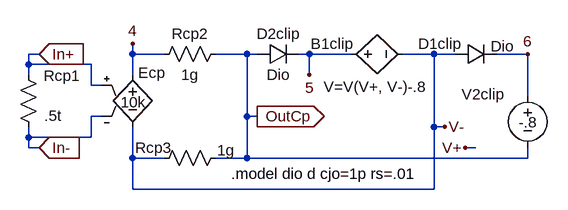
[diagram p0: schematic Comp.asc]
Comp.asc, the LTspice schematic file:
Version 4
SHEET 1 932 680
WIRE 96 176 96 160
WIRE 96 192 96 176
WIRE 96 288 96 272
WIRE 96 304 96 288
WIRE 112 160 96 160
WIRE 112 304 96 304
WIRE 192 176 96 176
WIRE 192 208 192 176
WIRE 192 288 96 288
WIRE 192 288 192 256
WIRE 208 208 192 208
WIRE 208 256 192 256
WIRE 256 160 256 144
WIRE 256 192 256 160
WIRE 256 320 256 272
WIRE 256 368 256 320
WIRE 304 160 256 160
WIRE 304 320 256 320
WIRE 432 160 384 160
WIRE 432 256 432 160
WIRE 432 320 384 320
WIRE 432 320 432 256
WIRE 448 160 432 160
WIRE 448 256 432 256
WIRE 528 160 512 160
WIRE 528 192 528 160
WIRE 592 160 528 160
WIRE 720 160 672 160
WIRE 720 272 720 160
WIRE 720 368 256 368
WIRE 720 368 720 272
WIRE 736 272 720 272
WIRE 752 160 720 160
WIRE 784 304 768 304
WIRE 864 160 816 160
WIRE 864 224 864 160
WIRE 864 320 432 320
WIRE 864 320 864 304
FLAG 112 160 In+
IOPIN 112 160 In
FLAG 112 304 In-
IOPIN 112 304 In
FLAG 256 144 4
FLAG 736 272 V-
FLAG 448 256 OutCp
IOPIN 448 256 Out
FLAG 528 192 5
FLAG 768 304 V+
FLAG 864 160 6
SYMBOL res 80 176 R0
WINDOW 0 39 17 Left 0
WINDOW 3 40 79 Left 0
SYMATTR InstName Rcp1
SYMATTR Value .5t
SYMBOL e 256 176 R0
WINDOW 0 9 13 Left 0
WINDOW 3 -18 58 Left 0
SYMATTR InstName Ecp
SYMATTR Value 10k
SYMBOL res 400 144 R90
WINDOW 0 0 56 VBottom 0
WINDOW 3 32 56 VTop 0
SYMATTR InstName Rcp2
SYMATTR Value 1g
SYMBOL res 400 304 R90
WINDOW 0 16 112 VBottom 0
WINDOW 3 -12 0 VTop 0
SYMATTR InstName Rcp3
SYMATTR Value 1g
SYMBOL bv 576 160 R270
WINDOW 0 0 -13 VTop 0
WINDOW 3 -35 53 VBottom 0
SYMATTR InstName B1clip
SYMATTR Value V=V(V+, V-)-.8
SYMBOL diode 752 176 R270
WINDOW 0 16 -23 VTop 0
WINDOW 3 44 73 VBottom 0
SYMATTR InstName D1clip
SYMATTR Value Dio
SYMBOL voltage 864 208 R0
WINDOW 0 -102 14 Left 0
WINDOW 3 -14 57 Left 0
WINDOW 123 0 0 Left 0
WINDOW 39 0 0 Left 0
SYMATTR InstName V2clip
SYMATTR Value -.8
SYMBOL diode 448 176 R270
WINDOW 0 32 32 VTop 0
WINDOW 3 0 32 VBottom 0
SYMATTR InstName D2clip
SYMATTR Value Dio
TEXT 408 344 Left 0 !.model dio d cjo=1p rs=.01

The netlist it stands for:
* Comp.asc
Rcp1 In+ In- .5t
Ecp 4 V- In+ In- 10k
Rcp2 OutCp 4 1g
Rcp3 OutCp V- 1g
B1clip 5 V- V=V(V+, V-)-.8
D1clip V- 6 Dio
V2clip 6 OutCp -.8
D2clip OutCp 5 Dio
.model D D
.lib standard.dio
.model dio d cjo=1p rs=.01
.backanno
.end